# EAGLE design PiGRRL-ButtonPCB (EAGLE 6.4)
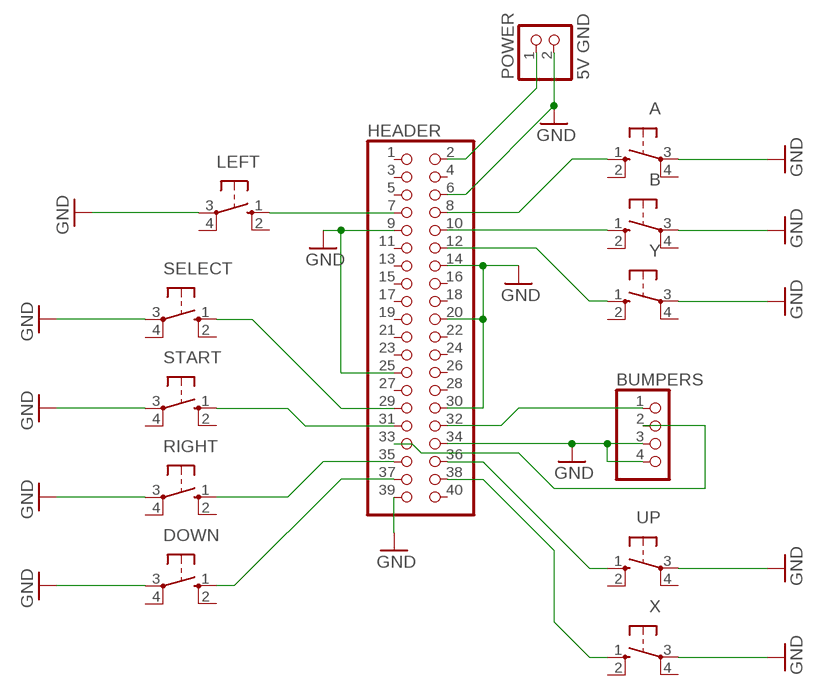
[diagram p0: schematic, sheet 1]

## Parts
A  10-XX  [B3F-10XX]
B  10-XX  [B3F-10XX]
BUMPERS  PINHD-1X4  [1X04]
DOWN  10-XX  [B3F-10XX]
HEADER  PINHD-2X20  [2X20]
LEFT  10-XX  [B3F-10XX]
POWER  5V GND  PINHD-1X2  [1X02]
RIGHT  10-XX  [B3F-10XX]
SELECT  10-XX  [B3F-10XX]
START  10-XX  [B3F-10XX]
UP  10-XX  [B3F-10XX]
X  10-XX  [B3F-10XX]
Y  10-XX  [B3F-10XX]

## Nets
+5V: HEADER.2 POWER.1
GND: A.3(P) B.3(P) BUMPERS.3 BUMPERS.4 DOWN.3(P) HEADER.6 HEADER.9 HEADER.14 HEADER.20 HEADER.25 HEADER.30 HEADER.34 HEADER.39 LEFT.3(P) POWER.2 RIGHT.3(P) SELECT.3(P) START.3(P) UP.3(P) X.3(P) Y.3(P)
N$1: HEADER.7 LEFT.1(S)
N$2: HEADER.36 UP.1(S)
N$3: HEADER.12 Y.1(S)
N$4: HEADER.35 RIGHT.1(S)
N$5: DOWN.1(S) HEADER.37
N$6: HEADER.38 X.1(S)
N$7: A.1(S) HEADER.8
N$8: B.1(S) HEADER.10
N$9: HEADER.29 SELECT.1(S)
N$10: HEADER.31 START.1(S)
N$12: BUMPERS.1 HEADER.32
N$13: BUMPERS.2 HEADER.33
Unconnected: A.2(S1) A.4(P1) B.2(S1) B.4(P1) DOWN.2(S1) DOWN.4(P1) HEADER.1 HEADER.3 HEADER.4 HEADER.5 HEADER.11 HEADER.13 HEADER.15 HEADER.16 HEADER.17 HEADER.18 HEADER.19 HEADER.21 HEADER.22 HEADER.23 HEADER.24 HEADER.26 HEADER.27 HEADER.28 HEADER.40 LEFT.2(S1) LEFT.4(P1) RIGHT.2(S1) RIGHT.4(P1) SELECT.2(S1) SELECT.4(P1) START.2(S1) START.4(P1) UP.2(S1) UP.4(P1) X.2(S1) X.4(P1) Y.2(S1) Y.4(P1)

## Library data of the parts
A B DOWN LEFT RIGHT SELECT START UP X Y = switch-omron:10-XX: OMRON SWITCH; MPN: B3F-1000; OC_FARNELL: 176432; OC_NEWARK: 36M3542
BUMPERS = pinhead:PINHD-1X4: PIN HEADER
HEADER = pinhead:PINHD-2X20: PIN HEADER
POWER = pinhead:PINHD-1X2: PIN HEADER

## Net classes
0 default: width 0.305 mm, drill 0.508 mm, clearance 0.254 mm

## Board
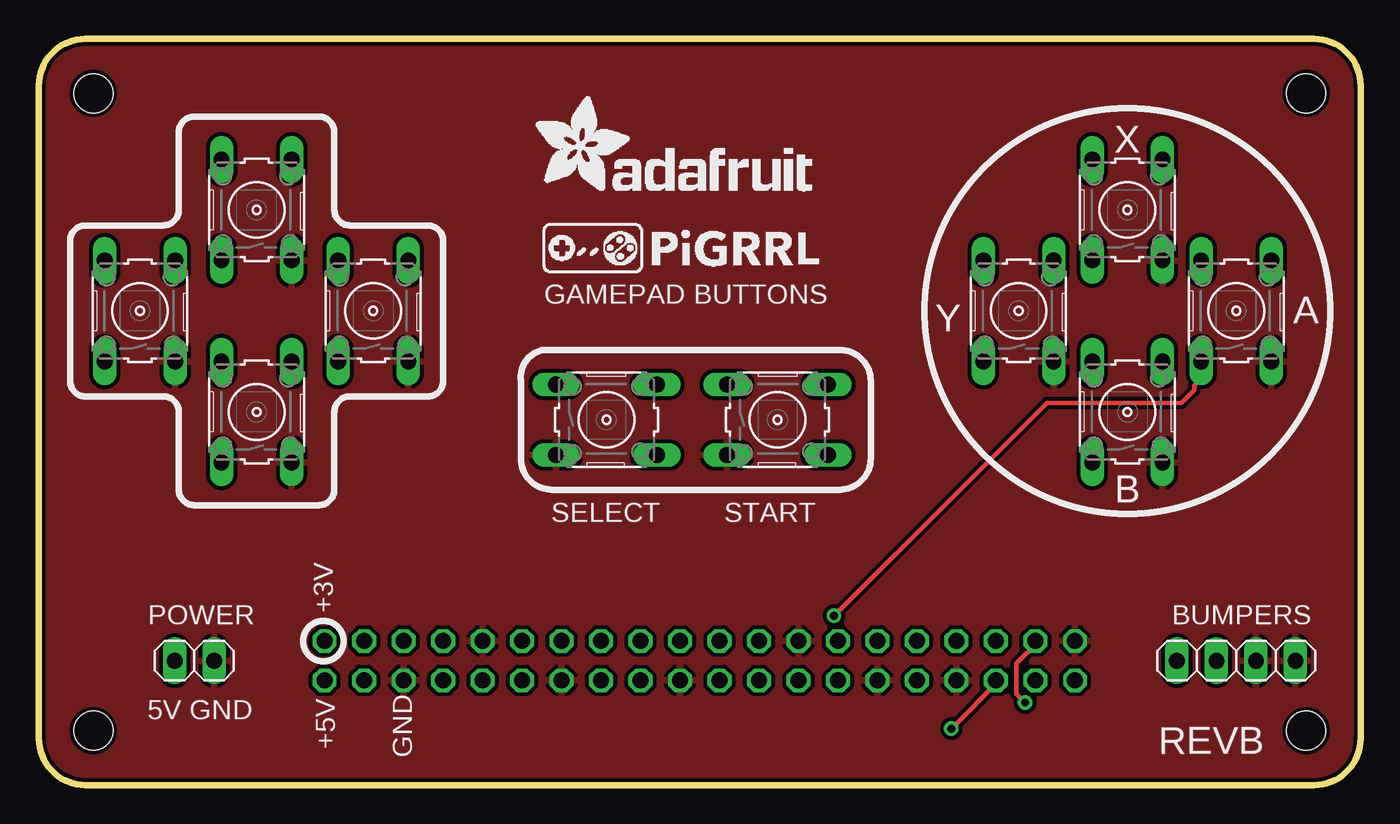
[diagram p1: board, top side]
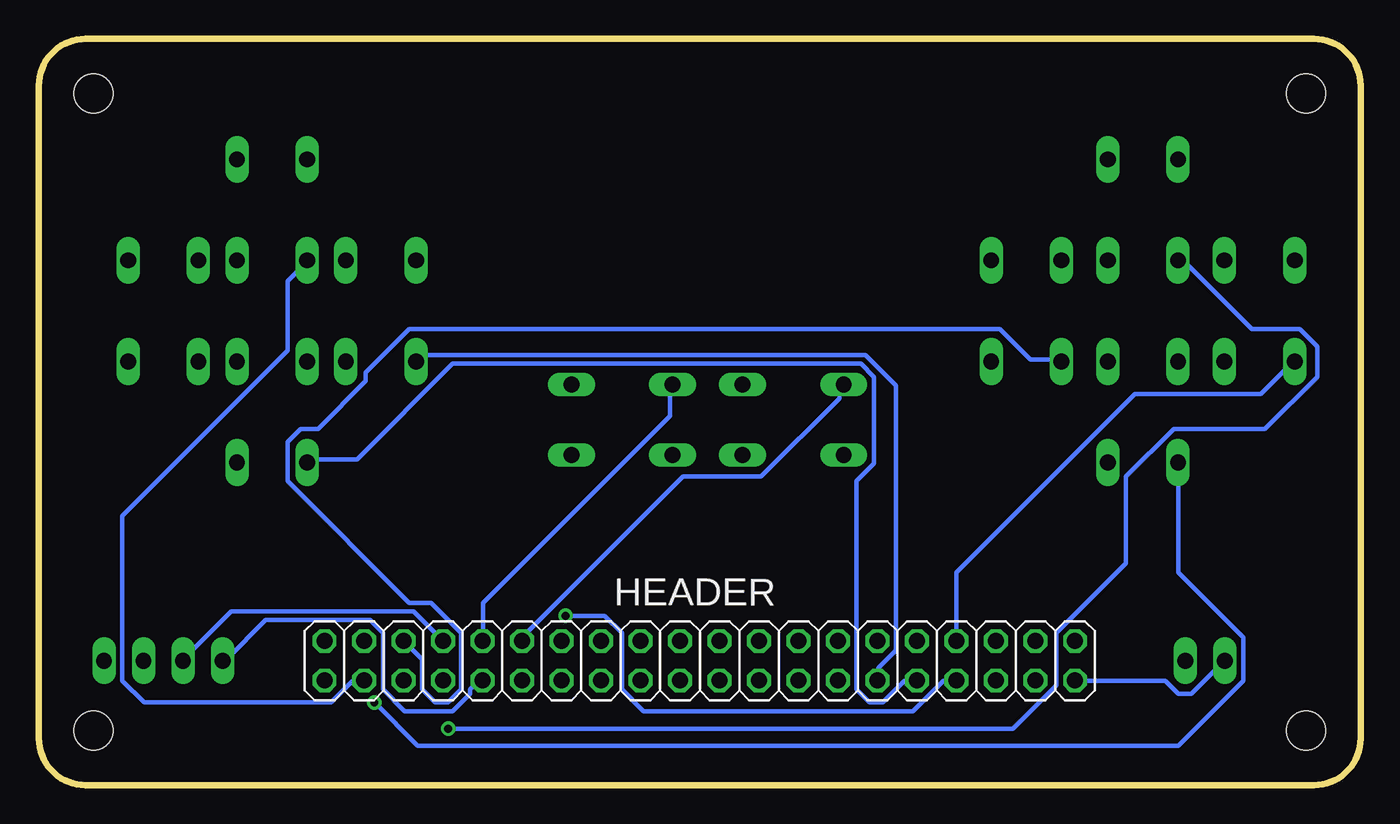
[diagram p2: board, bottom side, seen from below]

Size 85 x 48 mm. Coordinates in mm from the lower left corner, seen from the top.
Outline: 85,45 85,3 arc-90 82,0 3,0 arc-90 0,3 0,45 arc-90 3,48 82,48 arc-90 85,45
Copper layers (1*16): Top 0.035mm / dielectric 1.5mm / Bottom 0.035mm
Design rules "adafruit": minimum track width 8mil, minimum drill 15.5mil, track to track 8mil, track to pad 8mil, pad to pad 8mil, via to via 8mil, smd to smd 8mil, copper to edge 10mil, drill to drill 8mil, minimum pad ring 10mil, minimum via ring 8mil, stop-mask expansion 2mil, vias tented up to drill 20mil, thermal gap 10mil
Holes 2.5 mm at 3.5,44.5 3.5,3.5 81.5,3.5 81.5,44.5

### Footprints (pad centres in the part's own frame; a part is rotated, then mirrored left to right if it is on the bottom)
B3F-10XX = drill 1.016 long: 1 -3.251,2.261; 2 3.251,2.261; 3 -3.251,-2.261; 4 3.251,-2.261
1X04 = drill 1.016 long: 1 -3.81,0; 2 -1.27,0; 3 1.27,0; 4 3.81,0
2X20 = drill 1.016 octagon: 1 -24.13,-1.27; 2 -24.13,1.27; 3 -21.59,-1.27; 4 -21.59,1.27; 5 -19.05,-1.27; 6 -19.05,1.27; 7 -16.51,-1.27; 8 -16.51,1.27; 9 -13.97,-1.27; 10 -13.97,1.27; 11 -11.43,-1.27; 12 -11.43,1.27; 13 -8.89,-1.27; 14 -8.89,1.27; 15 -6.35,-1.27; 16 -6.35,1.27; 17 -3.81,-1.27; 18 -3.81,1.27; 19 -1.27,-1.27; 20 -1.27,1.27; 21 1.27,-1.27; 22 1.27,1.27; 23 3.81,-1.27; 24 3.81,1.27; 25 6.35,-1.27; 26 6.35,1.27; 27 8.89,-1.27; 28 8.89,1.27; 29 11.43,-1.27; 30 11.43,1.27; 31 13.97,-1.27; 32 13.97,1.27; 33 16.51,-1.27; 34 16.51,1.27; 35 19.05,-1.27; 36 19.05,1.27; 37 21.59,-1.27; 38 21.59,1.27; 39 24.13,-1.27; 40 24.13,1.27
1X02 = drill 1.016 long: 1 -1.27,0; 2 1.27,0

### Placement (x,y rotation side)
A  77,30.5 90 top
B  70,24 90 top
BUMPERS  77,8 0 top
DOWN  14,24 90 top
HEADER  42.5,8 180 bottom
LEFT  6.5,30.5 90 top
POWER  10,8 0 top
RIGHT  21.5,30.5 90 top
SELECT  36.5,23.5 0 top
START  47.5,23.5 0 top
UP  14,37 90 top
X  70,37 90 top
Y  63,30.5 90 top

### Tracks (layer width: path | path; a pad name or v marks a point on that pad's centre or on a via)
+5V
  Bottom 0.305: HEADER.2 18.16,6.71 12.57,6.71 11.73,5.87 10.9,5.87 8.94,7.82 POWER.1
GND
  pour Top: 0.5,3 0.5,45 arc-90 3,47.5 82,47.5 arc-90 84.5,45 84.5,3 arc-90 82,0.5 3,0.5 arc-90
N$1
  Bottom 0.305: HEADER.7 25.98,9.5 25.98,13.69 14.53,25.15 6.43,25.15 4.47,27.1 LEFT.1
N$2  (via drill 0.51)
  Top 0.305: v58.67,3.63 61.75,6.71 HEADER.36
  Bottom 0.305: v58.67,3.63 22.35,3.63 19.56,6.43 19.56,9.78 15.09,14.25 15.09,19.84 12.01,22.91 6.15,22.91 2.79,26.26 2.79,28.22 3.91,29.34 6.99,29.34 11.18,33.53 11.73,33.53 UP.1
N$3
  Bottom 0.305: HEADER.12 31.01,6.99 31.01,7.54 29.9,8.66 29.9,25.7 31.85,27.66 60.35,27.66 60.63,27.38 Y.1
N$4
  Bottom 0.305: RIGHT.1 19.28,27.38 21.23,27.38 23.19,29.34 61.19,29.34 63.98,26.54 63.98,25.98 67.06,22.91 68.17,22.91 69.01,22.07 69.01,19.56 61.19,11.73 59.79,11.73 57.84,9.78 57.84,6.15 58.67,5.31 59.51,5.31 60.35,6.15 60.35,8.1 61.47,9.22 HEADER.35
N$5  (via drill 0.51)
  Top 0.305: v63.42,5.31 62.87,5.87 62.87,7.82 64.26,9.22 HEADER.37
  Bottom 0.305: v63.42,5.31 60.63,2.52 11.73,2.52 7.54,6.71 7.54,9.5 11.73,13.69 11.73,20.68 DOWN.1
N$6
  Bottom 0.305: HEADER.38 64.26,6.71 64.82,6.71 66.22,5.31 78.23,5.31 79.63,6.71 79.63,17.32 69.01,27.94 69.01,32.41 67.89,33.53 X.1
N$7  (via drill 0.51)
  Top 0.305: v51.13,10.9 64.82,24.59 73.48,24.59 74.32,25.43 74.32,25.7 74.6,25.98 74.6,27.1 A.1
  Bottom 0.305: v51.13,10.9 48.62,10.9 47.5,9.78 47.5,6.15 46.1,4.75 28.78,4.75 26.82,6.71 26.26,6.71 HEADER.8
N$8
  Bottom 0.305: HEADER.10 28.78,6.71 29.34,6.71 30.73,5.31 31.57,5.31 32.41,6.15 32.41,19.56 31.29,20.68 31.29,26.26 32.13,27.1 58.4,27.1 64.54,20.95 67.61,20.95 B.1
N$9
  Bottom 0.305: HEADER.29 53.92,9.5 43.59,19.84 38.56,19.84 33.53,24.87 33.53,25.7 SELECT.1
N$10
  Bottom 0.305: START.1 44.42,25.7 44.42,23.75 56.44,11.73 56.44,9.5 HEADER.31
N$12
  Bottom 0.305: HEADER.32 56.72,6.71 57.28,6.15 57.28,5.87 58.4,4.75 61.47,4.75 62.87,6.15 62.87,9.78 63.7,10.62 70.41,10.62 72.92,8.1 BUMPERS.1
N$13
  Bottom 0.305: BUMPERS.2 75.72,8.1 72.64,11.18 60.91,11.18 59.23,9.5 HEADER.33

### Text on the board
tPlace: GAMEPAD BUTTONS | +3V | +5V | GND | REVB